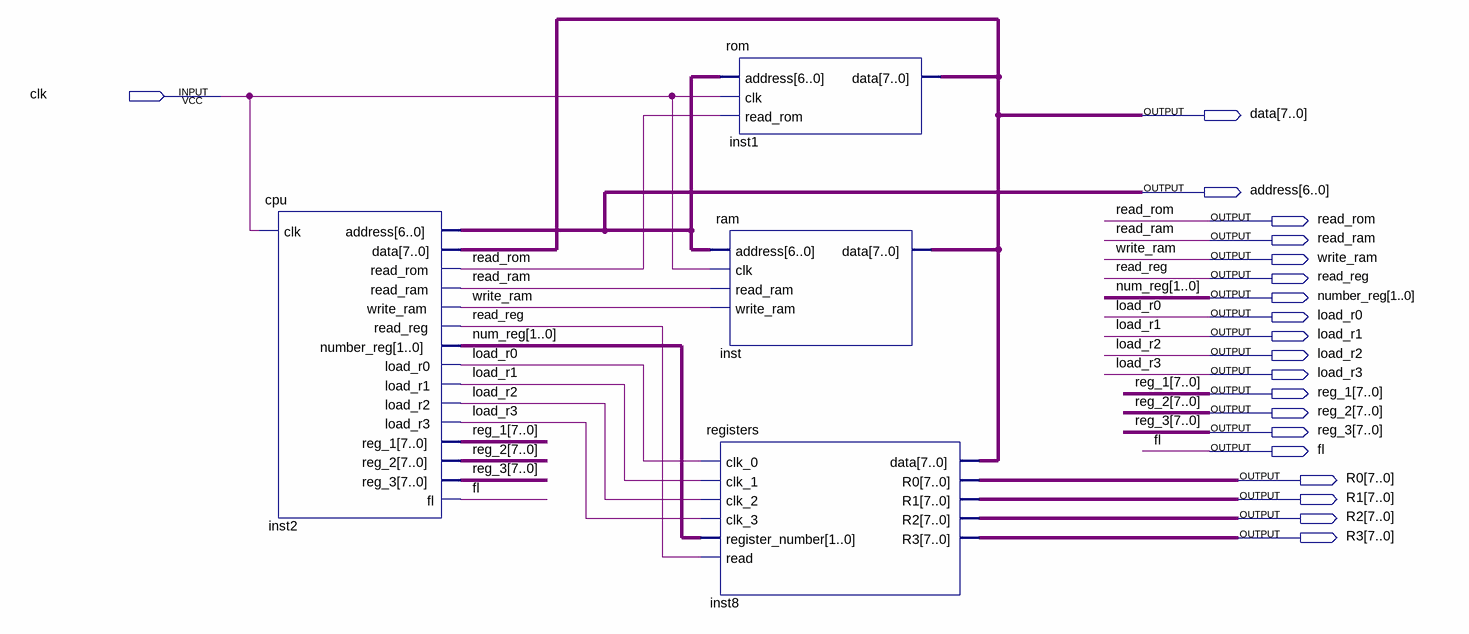
[diagram p0: schematic sheet]
// Quartus schematic lab4.bdf as structural Verilog: 4 symbols, 20 pins
module lab4 (
  input  clk,
  output [7:0] data,
  output [6:0] address,
  output read_rom,
  output read_ram,
  output write_ram,
  output read_reg,
  output [1:0] number_reg,
  output load_r0,
  output load_r1,
  output load_r2,
  output load_r3,
  output [7:0] reg_1,
  output [7:0] reg_2,
  output [7:0] reg_3,
  output fl,
  output [7:0] R0,
  output [7:0] R1,
  output [7:0] R2,
  output [7:0] R3
);

  cpu inst2 (
    .clk(clk), .address(address), .read_rom(read_rom), .read_ram(read_ram), .write_ram(write_ram),
    .read_reg(read_reg), .number_reg(number_reg), .load_r0(load_r0), .load_r1(load_r1), .load_r2(load_r2),
    .load_r3(load_r3), .reg_1(reg_1), .reg_2(reg_2), .reg_3(reg_3), .fl(fl), .data(data));
  registers inst8 (
    .clk_0(load_r0), .clk_1(load_r1), .clk_2(load_r2), .clk_3(load_r3), .register_number(number_reg),
    .read(read_reg), .R0(R0), .R1(R1), .R2(R2), .R3(R3), .data(data));
  rom inst1 (.address(address), .clk(clk), .read_rom(read_rom), .data(data));
  ram inst (.address(address), .clk(clk), .read_ram(read_ram), .write_ram(write_ram), .data(data));

  // Other names for the same wires on the sheet: num_reg[1:0] = number_reg
endmodule
